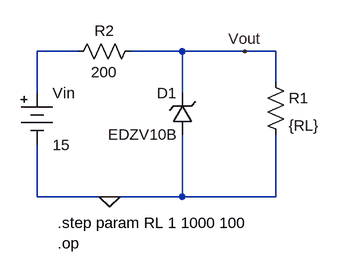
[diagram p0: schematic Exp 1.asc]
Exp 1.asc, the LTspice schematic file:
Version 4
SHEET 1 880 680
WIRE 80 32 16 32
WIRE 240 32 160 32
WIRE 336 32 240 32
WIRE 384 32 336 32
WIRE 384 80 384 32
WIRE 16 96 16 32
WIRE 240 96 240 32
WIRE 16 256 16 176
WIRE 128 256 16 256
WIRE 240 256 240 160
WIRE 240 256 128 256
WIRE 384 256 384 160
WIRE 384 256 240 256
FLAG 128 256 0
FLAG 336 32 Vout
SYMBOL zener 256 160 R180
WINDOW 0 24 64 Left 2
WINDOW 3 24 0 Left 2
SYMATTR InstName D1
SYMATTR Value EDZV10B
SYMBOL Misc\\battery 16 80 R0
WINDOW 123 0 0 Left 0
WINDOW 39 0 0 Left 0
SYMATTR InstName Vin
SYMATTR Value 15
SYMBOL res 176 16 R90
WINDOW 0 0 56 VBottom 2
WINDOW 3 32 56 VTop 2
SYMATTR InstName R2
SYMATTR Value 200
SYMBOL res 368 64 R0
WINDOW 3 36 82 Left 2
SYMATTR Value {RL}
SYMATTR InstName R1
TEXT 48 296 Left 2 !.step param RL 1 1000 100
TEXT 48 328 Left 2 !.op

The netlist it stands for:
* Exp 1.asc
D1 0 Vout EDZV10B
Vin N001 0 15
R2 Vout N001 200
R1 Vout 0 {RL}
.model D D
.lib standard.dio
.step param RL 1 1000 100
.op
.backanno
.end